# EAGLE board main (EAGLE 9.4.2), part 1 of 5
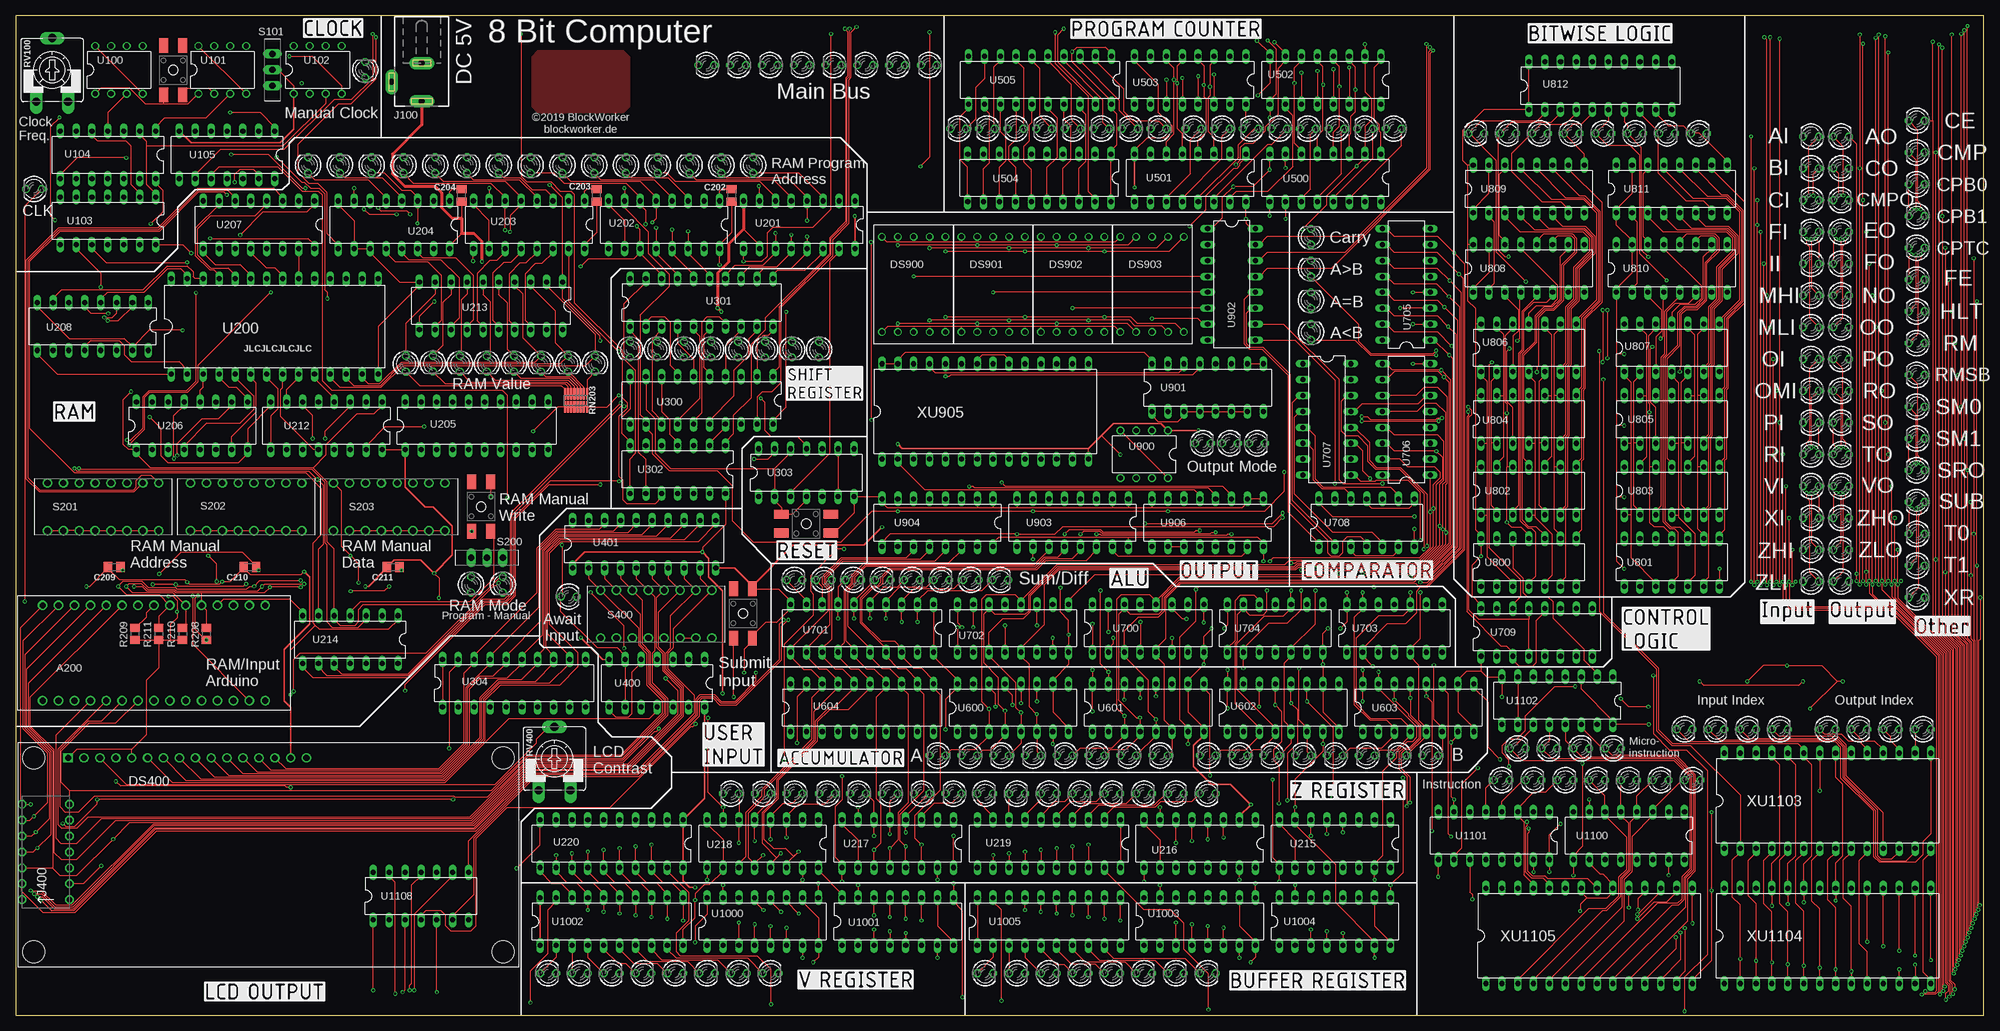
[diagram p13: board, top side]
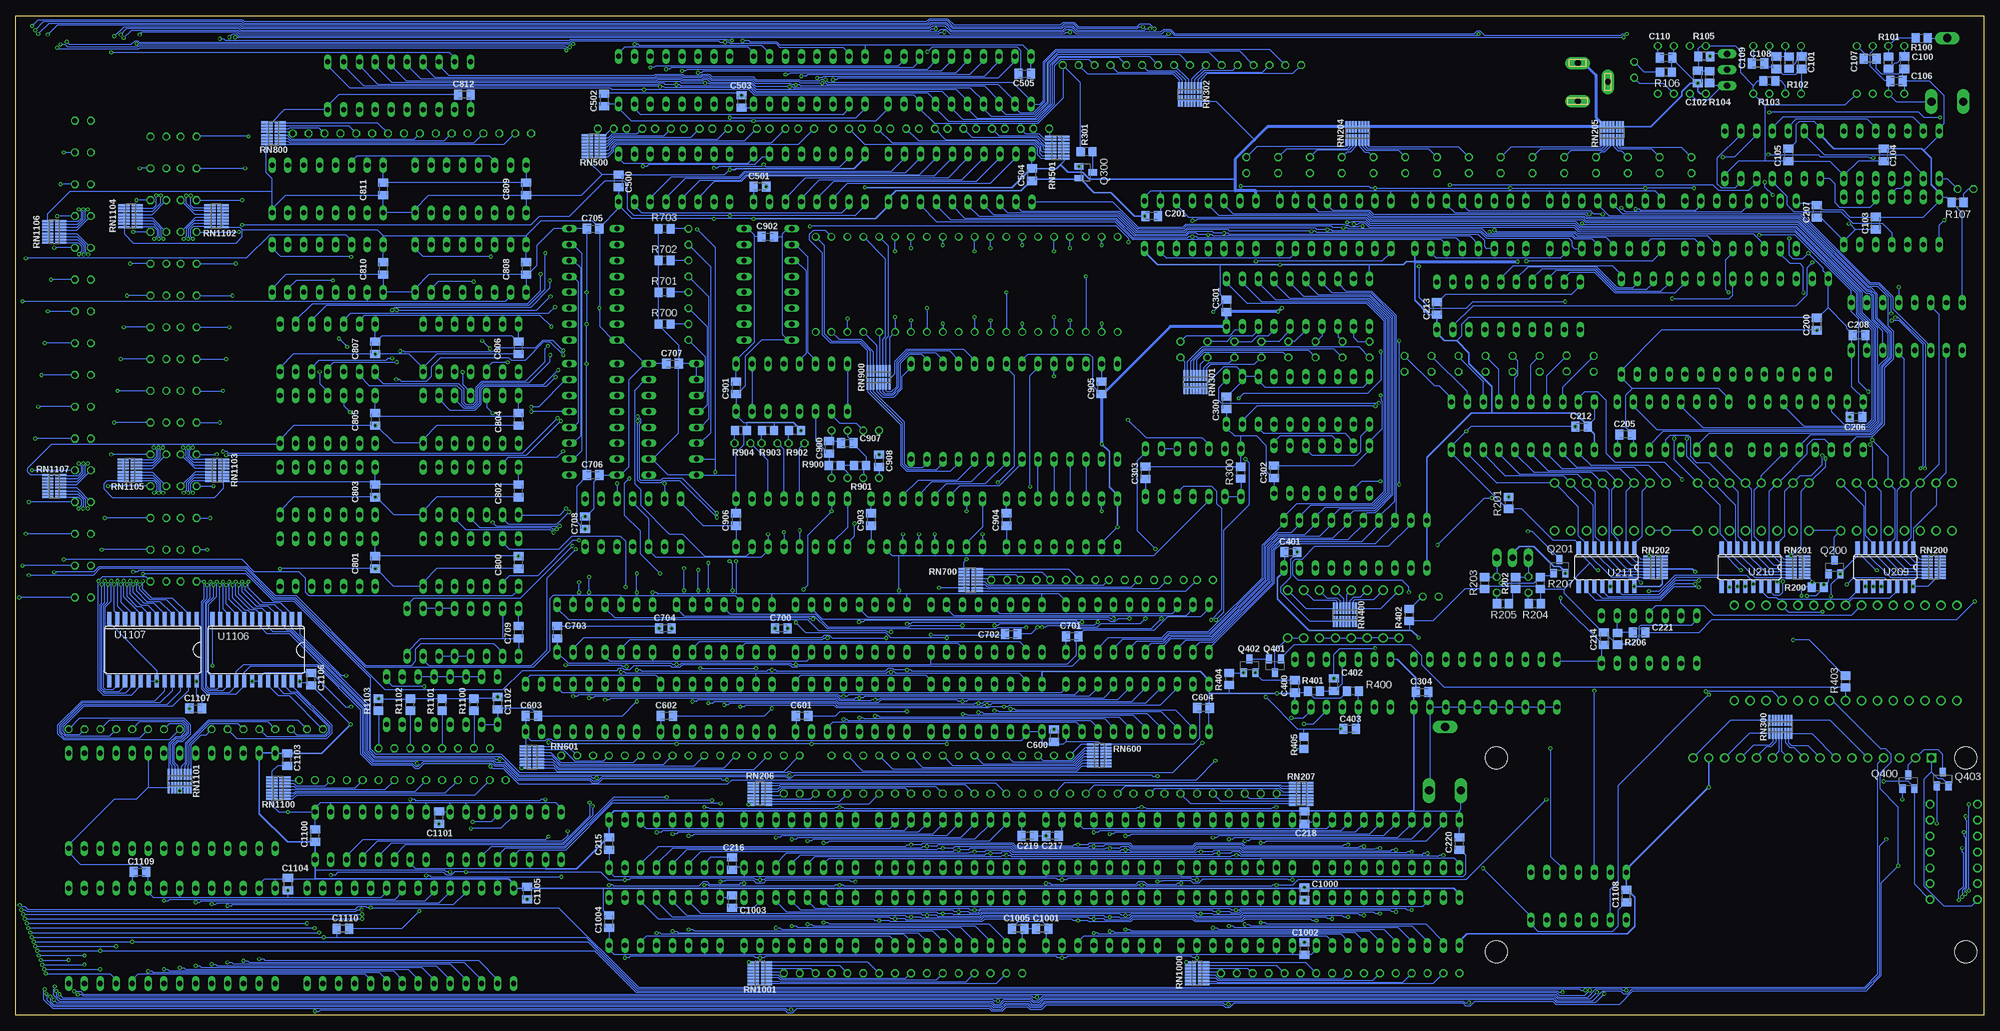
[diagram p14: board, bottom side, seen from below]

Size 314.53 x 159.79 mm. Coordinates in mm from the lower left corner, seen from the top.
Outline: 0,0 314.53,0 314.53,159.79 0,159.79 0,0
Copper layers (1*16): Top 0.035mm / dielectric 1.5mm / Bottom 0.035mm
Design rules "jlcpcb-2l": minimum track width 5mil, minimum drill 0.3mm, track to track 5mil, track to pad 5mil, pad to pad 5mil, via to via 5mil, smd to smd 0mil, copper to edge 0.25mm, drill to drill 6mil, minimum pad ring 6mil, minimum via ring 6mil, stop-mask expansion 4mil, vias tented up to drill 0.3mm, thermal gap 10mil

## Footprints (pad centres in the part's own frame; a part is rotated, then mirrored left to right if it is on the bottom)
ARDUINO_NANO_V3 = drill 1: 1 -17.78,-7.62; 2 -15.24,-7.62; 3 -12.7,-7.62; 4 -10.16,-7.62; 5 -7.62,-7.62; 6 -5.08,-7.62; 7 -2.54,-7.62; 8 0,-7.62; 9 2.54,-7.62; 10 5.08,-7.62; 11 7.62,-7.62; 12 10.16,-7.62; 13 12.7,-7.62; 14 15.24,-7.62; 15 17.78,-7.62; 16 17.78,7.62; 17 15.24,7.62; 18 12.7,7.62; 19 10.16,7.62; 20 7.62,7.62; 21 5.08,7.62; 22 2.54,7.62; 23 0,7.62; 24 -2.54,7.62; 25 -5.08,7.62; 26 -7.62,7.62; 27 -10.16,7.62; 28 -12.7,7.62; 29 -15.24,7.62; 30 -17.78,7.62
C0805K = smd 1.3 x 1.6: 1 -1,0; 2 1,0
HD44780_LCD = drill 1 square: 1 -32,15.5 | drill 1: 2 -29.46,15.5; 3 -26.92,15.5; 4 -24.38,15.5; 5 -21.84,15.5; 6 -19.3,15.5; 7 -16.76,15.5; 8 -14.22,15.5; 9 -11.68,15.5; 10 -9.14,15.5; 11 -6.6,15.5; 12 -4.06,15.5; 13 -1.52,15.5; 14 1.02,15.5; 15 3.56,15.5; 16 6.1,15.5 | hole 3.5: -37.5,15.5; 37.5,15.5; 37.5,-15.5; -37.5,-15.5
LED_7SEG = drill 0.8: 1 -5.08,-7.62; 2 -2.54,-7.62; 3 0,-7.62; 4 2.54,-7.62; 5 5.08,-7.62; 6 5.08,7.62; 7 2.54,7.62; 8 0,7.62; 9 -2.54,7.62; 10 -5.08,7.62
DCJ0202 = drill 1 pad 2 long: 1 0,3.1; 2 4.8,0; 3 0,-3
90152-14 = drill 0.9 octagon: 1 -3.81,-8.89; 2 3.81,-8.89; 3 -3.81,-6.35; 4 3.81,-6.35; 5 -3.81,-3.81; 6 3.81,-3.81; 7 -3.81,-1.27; 8 3.81,-1.27; 9 -3.81,1.27; 10 3.81,1.27; 11 -3.81,3.81; 12 3.81,3.81; 13 -3.81,6.35; 14 3.81,6.35
LED3MM = drill 0.813 octagon: A -1.27,0; K 1.27,0
SOT23 = smd 1 x 1.4: 1 -0.95,-1.1; 2 0.95,-1.1; 3 0,1.1
R0805 = smd 1.3 x 1.5: 1 -0.95,0; 2 0.95,0
CAY16102J8LF = smd 0.325 x 1.8: 1 -1.75,-1.05; 2 -1.25,-1.05; 3 -0.75,-1.05; 4 -0.25,-1.05; 5 0.25,-1.05; 6 0.75,-1.05; 7 1.25,-1.05; 8 1.75,-1.05; 9 -1.75,1.05; 10 -1.25,1.05; 11 -0.75,1.05; 12 -0.25,1.05; 13 0.25,1.05; 14 0.75,1.05; 15 1.25,1.05; 16 1.75,1.05
CA9V = drill 1.321 long: A -2.54,-5.08; E 2.54,-5.08; S 0,5.08
TL3305_MICROSWITCH = smd 2.3 x 1.4: 1 -1.7,0.75; 2 6.2,0.75; 3 -1.7,3.75; 4 6.2,3.75
ESP10 = drill 1 long: 1 0,2.54; 2 0,-2.54; C 0,0
DIPSW-08 = drill 1: A1 -8.89,-3.81; A2 -6.35,-3.81; A3 -3.81,-3.81; A4 -1.27,-3.81; A5 1.27,-3.81; A6 3.81,-3.81; A7 6.35,-3.81; A8 8.89,-3.81; B1 -8.89,3.81; B2 -6.35,3.81; B3 -3.81,3.81; B4 -1.27,3.81; B5 1.27,3.81; B6 3.81,3.81; B7 6.35,3.81; B8 8.89,3.81
DIL08 = drill 0.813 pad 1.27: 1 -3.81,-3.81; 2 -1.27,-3.81; 3 1.27,-3.81; 4 3.81,-3.81; 5 3.81,3.81; 6 1.27,3.81; 7 -1.27,3.81; 8 -3.81,3.81
DIL14 = drill 0.813 long: 1 -7.62,-3.81; 2 -5.08,-3.81; 3 -2.54,-3.81; 4 0,-3.81; 5 2.54,-3.81; 6 5.08,-3.81; 7 7.62,-3.81; 8 7.62,3.81; 9 5.08,3.81; 10 2.54,3.81; 11 0,3.81; 12 -2.54,3.81; 13 -5.08,3.81; 14 -7.62,3.81
DIL28-6 = drill 0.813 long: 1 -16.51,-7.62; 2 -13.97,-7.62; 3 -11.43,-7.62; 4 -8.89,-7.62; 5 -6.35,-7.62; 6 -3.81,-7.62; 7 -1.27,-7.62; 8 1.27,-7.62; 9 3.81,-7.62; 10 6.35,-7.62; 11 8.89,-7.62; 12 11.43,-7.62; 13 13.97,-7.62; 14 16.51,-7.62; 15 16.51,7.62; 16 13.97,7.62; 17 11.43,7.62; 18 8.89,7.62; 19 6.35,7.62; 20 3.81,7.62; 21 1.27,7.62; 22 -1.27,7.62; 23 -3.81,7.62; 24 -6.35,7.62; 25 -8.89,7.62; 26 -11.43,7.62; 27 -13.97,7.62; 28 -16.51,7.62
DIL16 = drill 0.813 long: 1 -8.89,-3.81; 2 -6.35,-3.81; 3 -3.81,-3.81; 4 -1.27,-3.81; 5 1.27,-3.81; 6 3.81,-3.81; 7 6.35,-3.81; 8 8.89,-3.81; 9 8.89,3.81; 10 6.35,3.81; 11 3.81,3.81; 12 1.27,3.81; 13 -1.27,3.81; 14 -3.81,3.81; 15 -6.35,3.81; 16 -8.89,3.81
SO16 = smd 0.66 x 2.032: 1 -4.445,-3.073; 2 -3.175,-3.073; 3 -1.905,-3.073; 4 -0.635,-3.073; 5 0.635,-3.073; 6 1.905,-3.073; 7 3.175,-3.073; 8 4.445,-3.073; 9 4.445,3.073; 10 3.175,3.073; 11 1.905,3.073; 12 0.635,3.073; 13 -0.635,3.073; 14 -1.905,3.073; 15 -3.175,3.073; 16 -4.445,3.073
DIL20 = drill 0.813 long: 1 -11.43,-3.81; 2 -8.89,-3.81; 3 -6.35,-3.81; 4 -3.81,-3.81; 5 -1.27,-3.81; 6 1.27,-3.81; 7 3.81,-3.81; 8 6.35,-3.81; 9 8.89,-3.81; 10 11.43,-3.81; 11 11.43,3.81; 12 8.89,3.81; 13 6.35,3.81; 14 3.81,3.81; 15 1.27,3.81; 16 -1.27,3.81; 17 -3.81,3.81; 18 -6.35,3.81; 19 -8.89,3.81; 20 -11.43,3.81
SO24W = smd 0.66 x 2.032: 1 -6.985,-5.029; 2 -5.715,-5.029; 3 -4.445,-5.029; 4 -3.175,-5.029; 5 -1.905,-5.029; 6 -0.635,-5.029; 7 0.635,-5.029; 8 1.905,-5.029; 9 3.175,-5.029; 10 4.445,-5.029; 11 5.715,-5.029; 12 6.985,-5.029; 13 6.985,5.029; 14 5.715,5.029; 15 4.445,5.029; 16 3.175,5.029; 17 1.905,5.029; 18 0.635,5.029; 19 -0.635,5.029; 20 -1.905,5.029; 21 -3.175,5.029; 22 -4.445,5.029; 23 -5.715,5.029; 24 -6.985,5.029
DIL28 = drill 0.813 long: 1 -16.51,-7.62; 2 -13.97,-7.62; 3 -11.43,-7.62; 4 -8.89,-7.62; 5 -6.35,-7.62; 6 -3.81,-7.62; 7 -1.27,-7.62; 8 1.27,-7.62; 9 3.81,-7.62; 10 6.35,-7.62; 11 8.89,-7.62; 12 11.43,-7.62; 13 13.97,-7.62; 14 16.51,-7.62; 15 16.51,7.62; 16 13.97,7.62; 17 11.43,7.62; 18 8.89,7.62; 19 6.35,7.62; 20 3.81,7.62; 21 1.27,7.62; 22 -1.27,7.62; 23 -3.81,7.62; 24 -6.35,7.62; 25 -8.89,7.62; 26 -11.43,7.62; 27 -13.97,7.62; 28 -16.51,7.62

## Placement (x,y rotation side)
A200  ARDUINO_NANO_V3  [ARDUINO_NANO_V3]  22.1,57.91 0 top
C100  0.1µF  [C0805K]  12.7,152.27 270 bottom
C101  0.1µF  [C0805K]  29.08,152.27 270 bottom
C102  0.1µF  [C0805K]  45.72,149.99 270 bottom
C103  0.1µF  [C0805K]  17.27,126.62 90 bottom
C104  0.1µF  [C0805K]  16,137.54 90 bottom
C105  0.1µF  [C0805K]  31.24,137.54 90 bottom
C106  0.68µF  [C0805K]  13.97,149.35 0 bottom
C107  10nF  [C0805K]  18.16,152.91 0 bottom
C108  1µF  [C0805K]  33.15,152.27 90 bottom
C109  10nF  [C0805K]  36.07,152.15 0 bottom
C110  10nF  [C0805K]  50.8,153.03 0 bottom
C200  0.1µF  [C0805K]  26.67,110.49 270 bottom
C201  0.1µF  [C0805K]  132.97,127.76 0 bottom
C202  0.1µF  [C0805K]  114.43,131.06 90 top
C203  0.1µF  [C0805K]  92.84,131.06 90 top
C204  0.1µF  [C0805K]  71.25,131.06 90 top
C205  0.1µF  [C0805K]  57.28,92.84 0 bottom
C206  0.1µF  [C0805K]  20.45,95.63 180 bottom
C207  0.1µF  [C0805K]  26.67,128.52 90 bottom
C208  0.1µF  [C0805K]  19.94,108.71 0 bottom
C209  0.1µF  [C0805K]  15.75,71.63 0 top
C210  0.1µF  [C0805K]  37.47,71.63 0 top
C211  0.1µF  [C0805K]  60.33,71.63 0 top
C212  0.1µF  [C0805K]  64.26,94.11 180 bottom
C213  0.1µF  [C0805K]  87.38,113.03 90 bottom
C214  0.1µF  [C0805K]  60.71,60.2 90 bottom
C215  0.1µF  [C0805K]  219.71,27.43 90 bottom
C216  0.1µF  [C0805K]  200.03,24.26 90 bottom
C217  0.1µF  [C0805K]  148.84,28.7 0 bottom
C218  0.1µF  [C0805K]  108.58,31.62 90 bottom
C219  0.1µF  [C0805K]  152.78,28.7 180 bottom
C220  0.1µF  [C0805K]  83.82,27.43 90 bottom
C221  10nF  [C0805K]  55.12,61.21 180 bottom
C300  0.1µF  [C0805K]  121.03,97.92 90 bottom
C301  0.1µF  [C0805K]  121.03,113.41 270 bottom
C302  0.1µF  [C0805K]  113.41,86.87 90 bottom
C303  0.1µF  [C0805K]  133.99,86.74 270 bottom
C304  0.1µF  [C0805K]  89.79,51.69 180 bottom
C400  0.1µF  [C0805K]  110.11,52.58 90 bottom
C401  0.1µF  [C0805K]  110.74,74.04 180 bottom
C402  10nF  [C0805K]  103.89,52.83 270 bottom
C403  10nF  [C0805K]  101.35,45.82 0 bottom
C500  0.1µF  [C0805K]  218.19,133.35 90 bottom
C501  0.1µF  [C0805K]  195.58,132.46 0 bottom
C502  0.1µF  [C0805K]  220.47,146.3 90 bottom
C503  0.1µF  [C0805K]  198.5,146.05 90 bottom
C504  0.1µF  [C0805K]  152.15,134.37 90 bottom
C505  0.1µF  [C0805K]  153.29,150.5 0 bottom
C600  0.1µF  [C0805K]  148.59,44.7 270 bottom
C601  0.1µF  [C0805K]  188.85,47.88 180 bottom
C602  0.1µF  [C0805K]  210.44,47.88 180 bottom
C603  0.1µF  [C0805K]  232.03,47.88 180 bottom
C604  0.1µF  [C0805K]  124.71,49.15 180 bottom
C700  0.1µF  [C0805K]  192.15,61.85 0 bottom
C701  0.1µF  [C0805K]  145.67,60.58 0 bottom
C702  0.1µF  [C0805K]  155.45,60.96 180 bottom
C703  0.1µF  [C0805K]  227.97,61.21 270 bottom
C704  0.1µF  [C0805K]  210.69,61.85 0 bottom
C705  0.1µF  [C0805K]  222.25,125.73 180 bottom
C706  0.1µF  [C0805K]  222.25,86.36 180 bottom
C707  0.1µF  [C0805K]  209.55,104.14 0 bottom
C708  0.1µF  [C0805K]  223.52,78.74 270 bottom
C709  0.1µF  [C0805K]  234.19,61.21 270 bottom
C800  0.1µF  [C0805K]  234.19,72.39 270 bottom
C801  0.1µF  [C0805K]  257.05,72.39 270 bottom
C802  0.1µF  [C0805K]  234.19,83.82 270 bottom
C803  0.1µF  [C0805K]  257.05,83.82 270 bottom
C804  0.1µF  [C0805K]  234.19,95.25 270 bottom
C805  0.1µF  [C0805K]  257.05,95.25 270 bottom
C806  0.1µF  [C0805K]  234.19,106.68 270 bottom
C807  0.1µF  [C0805K]  257.05,106.68 270 bottom
C808  0.1µF  [C0805K]  232.92,119.38 270 bottom
C809  0.1µF  [C0805K]  232.92,132.08 270 bottom
C810  0.1µF  [C0805K]  255.78,119.38 270 bottom
C811  0.1µF  [C0805K]  255.78,132.08 270 bottom
C812  0.1µF  [C0805K]  242.82,147.19 180 bottom
C900  0.1µF  [C0805K]  184.53,90.81 90 bottom
C901  0.1µF  [C0805K]  199.39,100.33 270 bottom
C902  0.1µF  [C0805K]  194.31,124.46 0 bottom
C903  0.1µF  [C0805K]  177.8,79.25 90 bottom
C904  0.1µF  [C0805K]  156.21,79.25 90 bottom
C905  0.1µF  [C0805K]  140.97,100.33 270 bottom
C906  0.1µF  [C0805K]  199.39,79.25 90 bottom
C907  10nF  [C0805K]  181.61,91.44 180 bottom
C908  10nF  [C0805K]  176.53,88.65 90 bottom
C1000  0.1µF  [C0805K]  108.58,19.43 270 bottom
C1001  0.1µF  [C0805K]  150.5,13.84 0 bottom
C1002  0.1µF  [C0805K]  108.58,10.67 270 bottom
C1003  0.1µF  [C0805K]  200.03,18.16 270 bottom
C1004  0.1µF  [C0805K]  219.71,14.99 270 bottom
C1005  0.1µF  [C0805K]  154.31,13.84 180 bottom
C1100  0.1µF  [C0805K]  266.7,28.7 90 bottom
C1101  0.1µF  [C0805K]  246.89,31.62 90 bottom
C1102  0.1µF  [C0805K]  237.49,49.91 90 bottom
C1103  0.1µF  [C0805K]  271.14,40.89 270 bottom
C1104  0.1µF  [C0805K]  271.02,20.95 270 bottom
C1105  0.1µF  [C0805K]  232.79,19.56 270 bottom
C1106  0.1µF  [C0805K]  267.33,53.72 90 bottom
C1107  0.1µF  [C0805K]  285.75,49.02 180 bottom
C1108  0.1µF  [C0805K]  57.15,19.05 270 bottom
C1109  0.1µF  [C0805K]  294.64,22.91 0 bottom
C1110  0.1µF  [C0805K]  262.25,13.84 0 bottom
DS400  HD44780_LCD  [HD44780_LCD]  40.39,25.65 0 top
DS900  LED_7SEG_CC  [LED_7SEG]  143.51,116.84 0 top
DS901  LED_7SEG_CC  [LED_7SEG]  156.21,116.84 0 top
DS902  LED_7SEG_CC  [LED_7SEG]  168.91,116.84 0 top
DS903  LED_7SEG_CC  [LED_7SEG]  181.61,116.84 0 top
J100  DCJ0202  [DCJ0202]  64.9,149.22 180 top
J400  90152-14  [90152-14]  4.8,27.38 0 top
LED100  yellow  [LED3MM]  55.88,151.13 90 top
LED101  blue  [LED3MM]  2.92,132.08 180 top
LED200  green  [LED3MM]  72.77,68.83 270 top
LED201  red  [LED3MM]  77.85,68.83 270 top
LED202  red  [LED3MM]  92.58,104.14 270 top
LED203  red  [LED3MM]  88.27,104.14 270 top
LED204  red  [LED3MM]  83.95,104.14 270 top
LED205  red  [LED3MM]  79.63,104.14 270 top
LED206  red  [LED3MM]  75.31,104.14 270 top
LED207  red  [LED3MM]  70.99,104.14 270 top
LED208  red  [LED3MM]  66.67,104.19 270 top
LED209  red  [LED3MM]  62.36,104.14 270 top
LED210  yellow  [LED3MM]  117.86,135.89 90 top
LED211  yellow  [LED3MM]  112.78,135.89 90 top
LED212  yellow  [LED3MM]  107.7,135.89 90 top
LED213  yellow  [LED3MM]  102.62,135.89 90 top
LED214  yellow  [LED3MM]  97.54,135.89 90 top
LED215  yellow  [LED3MM]  92.46,135.89 90 top
LED216  yellow  [LED3MM]  87.38,135.89 90 top
LED217  yellow  [LED3MM]  82.3,135.89 90 top
LED218  yellow  [LED3MM]  77.22,135.89 90 top
LED219  yellow  [LED3MM]  72.14,135.89 90 top
LED220  yellow  [LED3MM]  67.06,135.89 90 top
LED221  yellow  [LED3MM]  61.98,135.89 90 top
LED222  yellow  [LED3MM]  56.9,135.89 90 top
LED223  yellow  [LED3MM]  51.82,135.89 90 top
LED224  yellow  [LED3MM]  46.74,135.89 90 top
LED225  red  [LED3MM]  190.5,35.43 0 top
LED226  red  [LED3MM]  185.42,35.43 0 top
LED227  red  [LED3MM]  180.34,35.43 0 top
LED228  red  [LED3MM]  175.26,35.43 0 top
LED229  red  [LED3MM]  170.18,35.43 0 top
LED230  red  [LED3MM]  165.1,35.43 0 top
LED231  red  [LED3MM]  160.02,35.43 0 top
LED232  red  [LED3MM]  154.94,35.43 0 top
LED233  red  [LED3MM]  149.86,35.43 180 top
LED234  red  [LED3MM]  144.78,35.43 180 top
LED235  red  [LED3MM]  139.7,35.43 180 top
LED236  red  [LED3MM]  134.62,35.43 180 top
LED237  red  [LED3MM]  129.67,35.43 180 top
LED238  red  [LED3MM]  124.46,35.43 180 top
LED239  red  [LED3MM]  119.38,35.43 180 top
LED240  red  [LED3MM]  114.3,35.43 180 top
LED300  red  [LED3MM]  98.17,106.43 270 top
LED301  red  [LED3MM]  102.49,106.43 270 top
LED302  red  [LED3MM]  106.81,106.43 270 top
LED303  red  [LED3MM]  111.12,106.43 270 top
LED304  red  [LED3MM]  115.44,106.43 270 top
LED305  red  [LED3MM]  119.76,106.43 270 top
LED306  red  [LED3MM]  124.08,106.43 270 top
LED307  red  [LED3MM]  128.4,106.43 270 top
LED308  blue  [LED3MM]  110.36,151.89 180 top
LED309  blue  [LED3MM]  115.44,151.89 180 top
LED310  blue  [LED3MM]  120.52,151.89 180 top
LED311  blue  [LED3MM]  125.6,151.89 180 top
LED312  blue  [LED3MM]  130.68,151.89 180 top
LED313  blue  [LED3MM]  135.76,151.89 180 top
LED314  blue  [LED3MM]  140.84,151.89 180 top
LED315  blue  [LED3MM]  145.92,151.89 180 top
LED400  pink  [LED3MM]  88.39,66.93 0 top
LED500  green  [LED3MM]  188.21,141.73 180 top
LED501  green  [LED3MM]  192.79,141.73 180 top
LED502  green  [LED3MM]  197.36,141.73 180 top
LED503  green  [LED3MM]  201.93,141.73 180 top
LED504  green  [LED3MM]  206.5,141.73 180 top
LED505  green  [LED3MM]  211.07,141.73 180 top
LED506  green  [LED3MM]  215.65,141.73 180 top
LED507  green  [LED3MM]  220.22,141.73 180 top
LED508  green  [LED3MM]  150.62,141.73 180 top
LED509  green  [LED3MM]  155.19,141.73 180 top
LED510  green  [LED3MM]  159.77,141.73 180 top
LED511  green  [LED3MM]  164.34,141.73 180 top
LED512  green  [LED3MM]  168.91,141.73 180 top
LED513  green  [LED3MM]  173.48,141.73 180 top
LED514  green  [LED3MM]  178.05,141.73 180 top
LED515  green  [LED3MM]  182.63,141.73 180 top
LED600  red  [LED3MM]  147.32,41.53 180 top
LED601  red  [LED3MM]  152.4,41.53 180 top
LED602  red  [LED3MM]  157.48,41.53 180 top
LED603  red  [LED3MM]  162.56,41.53 180 top
LED604  red  [LED3MM]  167.64,41.53 180 top
LED605  red  [LED3MM]  172.72,41.53 180 top
LED606  red  [LED3MM]  177.8,41.53 180 top
LED607  red  [LED3MM]  182.88,41.53 180 top
LED608  red  [LED3MM]  190.5,41.53 180 top
LED609  red  [LED3MM]  195.58,41.53 180 top
LED610  red  [LED3MM]  200.66,41.53 180 top
LED611  red  [LED3MM]  205.74,41.53 180 top
LED612  red  [LED3MM]  210.82,41.53 180 top
LED613  red  [LED3MM]  215.9,41.53 180 top
LED614  red  [LED3MM]  220.98,41.53 180 top
LED615  red  [LED3MM]  226.06,41.53 180 top
LED700  yellow  [LED3MM]  124.46,69.6 0 top
LED701  yellow  [LED3MM]  129.16,69.6 0 top
LED702  yellow  [LED3MM]  133.86,69.6 0 top
LED703  yellow  [LED3MM]  138.56,69.6 0 top
LED704  yellow  [LED3MM]  143.26,69.6 0 top
LED705  yellow  [LED3MM]  147.96,69.6 0 top
LED706  yellow  [LED3MM]  152.65,69.6 0 top
LED707  yellow  [LED3MM]  157.35,69.6 0 top
LED708  green  [LED3MM]  207.01,109.22 90 top
LED709  green  [LED3MM]  207.01,114.3 90 top
LED710  green  [LED3MM]  207.01,119.38 90 top
LED711  green  [LED3MM]  207.01,124.46 90 top
LED800  yellow  [LED3MM]  233.43,140.97 0 top
LED801  yellow  [LED3MM]  238.51,140.97 0 top
LED802  yellow  [LED3MM]  243.59,140.97 0 top
LED803  yellow  [LED3MM]  248.67,140.97 0 top
LED804  yellow  [LED3MM]  253.75,140.97 0 top
LED805  yellow  [LED3MM]  258.83,140.97 0 top
LED806  yellow  [LED3MM]  263.91,140.97 0 top
LED807  yellow  [LED3MM]  268.99,140.97 0 top
LED900  green  [LED3MM]  189.74,91.44 0 top
LED901  green  [LED3MM]  194.06,91.44 0 top
LED902  green  [LED3MM]  198.37,91.44 0 top
LED1000  red  [LED3MM]  85.09,6.73 0 top
LED1001  red  [LED3MM]  90.17,6.73 0 top
LED1002  red  [LED3MM]  95.25,6.73 0 top
LED1003  red  [LED3MM]  100.33,6.73 0 top
LED1004  red  [LED3MM]  105.41,6.73 0 top
LED1005  red  [LED3MM]  110.49,6.73 0 top
LED1006  red  [LED3MM]  115.57,6.73 0 top
LED1007  red  [LED3MM]  120.65,6.73 0 top
LED1008  red  [LED3MM]  154.94,6.73 0 top
LED1009  red  [LED3MM]  160.02,6.73 0 top
LED1010  red  [LED3MM]  165.1,6.73 0 top
LED1011  red  [LED3MM]  170.18,6.73 0 top
LED1012  red  [LED3MM]  175.26,6.73 0 top
LED1013  red  [LED3MM]  180.34,6.73 0 top
LED1014  red  [LED3MM]  185.42,6.73 0 top
LED1015  red  [LED3MM]  190.5,6.73 0 top
LED1100  green  [LED3MM]  237.49,37.59 0 top
LED1101  green  [LED3MM]  242.57,37.59 0 top
LED1102  green  [LED3MM]  247.65,37.59 0 top
LED1103  green  [LED3MM]  252.73,37.59 0 top
LED1104  green  [LED3MM]  257.81,37.59 0 top
LED1105  green  [LED3MM]  262.89,37.59 0 top
LED1106  green  [LED3MM]  267.97,37.59 0 top
LED1107  yellow  [LED3MM]  240.03,42.67 0 top
LED1108  yellow  [LED3MM]  245.11,42.67 0 top
LED1109  yellow  [LED3MM]  250.19,42.67 0 top
LED1110  yellow  [LED3MM]  255.27,42.67 0 top
LED1111  yellow  [LED3MM]  289.56,45.72 0 top
LED1112  yellow  [LED3MM]  294.64,45.72 0 top
LED1113  yellow  [LED3MM]  299.72,45.72 0 top
LED1114  yellow  [LED3MM]  304.8,45.72 0 top
LED1115  yellow  [LED3MM]  266.7,45.72 0 top
LED1116  yellow  [LED3MM]  271.78,45.72 0 top
LED1117  yellow  [LED3MM]  276.86,45.72 0 top
LED1118  yellow  [LED3MM]  281.94,45.72 0 top
LED1119  white  [LED3MM]  286.89,140.46 180 top
LED1120  white  [LED3MM]  286.89,135.38 180 top
LED1121  white  [LED3MM]  286.89,130.3 180 top
LED1122  white  [LED3MM]  286.89,125.22 180 top
LED1123  white  [LED3MM]  286.89,120.14 180 top
LED1124  white  [LED3MM]  286.89,115.06 180 top
LED1125  white  [LED3MM]  286.89,109.98 180 top
LED1126  white  [LED3MM]  286.89,104.9 180 top
LED1127  white  [LED3MM]  286.89,99.82 180 top
LED1128  white  [LED3MM]  286.89,94.74 180 top
LED1129  white  [LED3MM]  286.89,89.66 180 top
LED1130  white  [LED3MM]  286.89,84.58 180 top
LED1131  white  [LED3MM]  286.89,79.5 180 top
LED1132  white  [LED3MM]  286.89,74.42 180 top
LED1133  white  [LED3MM]  286.89,69.34 180 top
LED1134  white  [LED3MM]  291.72,140.46 0 top
LED1135  white  [LED3MM]  291.72,135.38 0 top
LED1136  white  [LED3MM]  291.72,130.3 0 top
LED1137  white  [LED3MM]  291.72,125.22 0 top
LED1138  white  [LED3MM]  291.72,120.14 0 top
LED1139  white  [LED3MM]  291.72,115.06 0 top
LED1140  white  [LED3MM]  291.72,109.98 0 top
LED1141  white  [LED3MM]  291.72,104.9 0 top
LED1142  white  [LED3MM]  291.72,99.82 0 top
LED1143  white  [LED3MM]  291.72,94.74 0 top
LED1144  white  [LED3MM]  291.72,89.66 0 top
LED1145  white  [LED3MM]  291.72,84.58 0 top
LED1146  white  [LED3MM]  291.72,79.5 0 top
LED1147  white  [LED3MM]  291.72,74.42 0 top
LED1148  white  [LED3MM]  291.72,69.34 0 top
LED1149  white  [LED3MM]  303.78,143 180 top
LED1150  white  [LED3MM]  303.78,137.92 180 top
LED1151  white  [LED3MM]  303.78,132.84 180 top
LED1152  white  [LED3MM]  303.78,127.76 180 top
LED1153  white  [LED3MM]  303.78,122.68 180 top
LED1154  white  [LED3MM]  303.78,117.6 180 top
LED1155  white  [LED3MM]  303.78,112.52 180 top
LED1156  white  [LED3MM]  303.78,107.44 180 top
LED1157  white  [LED3MM]  303.78,102.36 180 top
LED1158  white  [LED3MM]  303.78,97.28 180 top
LED1159  white  [LED3MM]  303.78,92.2 180 top
LED1160  white  [LED3MM]  303.78,87.12 180 top
LED1161  white  [LED3MM]  303.78,82.04 180 top
LED1162  white  [LED3MM]  303.78,76.96 180 top
LED1163  white  [LED3MM]  303.78,71.88 180 top
LED1164  white  [LED3MM]  303.78,66.8 180 top
Q200  NMOS  [SOT23]  23.88,71.63 0 bottom
Q201  PMOS  [SOT23]  67.82,71.75 0 bottom
Q300  PMOS  [SOT23]  143.51,134.75 270 bottom
Q400  PMOS  [SOT23]  12.06,37.34 0 bottom
Q401  NMOS  [SOT23]  113.28,55.88 180 bottom
Q402  NMOS  [SOT23]  117.35,55.88 0 bottom
Q403  NMOS  [SOT23]  6.58,37.77 0 bottom
R100  150Ω  [R0805]  9.91,156.21 0 bottom
R101  150Ω  [R0805]  15.24,152.27 90 bottom
R102  200kΩ  [R0805]  31.11,152.27 90 bottom
R103  1kΩ  [R0805]  34.29,149.35 180 bottom
R104  1kΩ  [R0805]  43.81,149.99 90 bottom
R105  1kΩ  [R0805]  44.7,153.29 180 bottom
R106  330Ω  [R0805]  50.8,150.75 180 bottom
R107  330Ω?  [R0805]  4.19,129.92 0 bottom
R200  10kΩ  [R0805]  26.54,68.45 180 bottom
R201  1kΩ  [R0805]  75.95,81.92 270 bottom
R202  1kΩ  [R0805]  74.8,69.09 90 bottom
R203  1kΩ  [R0805]  79.76,69.09 90 bottom
R204  330Ω  [R0805]  71.75,65.79 180 bottom
R205  330Ω  [R0805]  76.83,65.79 180 bottom
R206  1kΩ  [R0805]  58.55,60.2 270 bottom
R207  10kΩ  [R0805]  70.87,69.09 90 bottom
R208  10kΩ  [R0805]  30.48,60.96 270 top
R209  10kΩ  [R0805]  19.05,60.96 270 top
R210  10kΩ  [R0805]  26.67,60.96 270 top
R211  10kΩ  [R0805]  22.86,60.96 270 top
R300  1kΩ  [R0805]  118.75,86.74 90 bottom
R301  330Ω?  [R0805]  143.38,138.05 180 bottom
R400  1kΩ  [R0805]  100.84,51.82 180 bottom
R401  1kΩ  [R0805]  107.06,51.82 180 bottom
R402  330Ω?  [R0805]  91.82,64.01 90 bottom
R403  10kΩ  [R0805]  22.1,53.34 90 bottom
R404  10kΩ  [R0805]  120.6,53.77 270 bottom
R405  1kΩ  [R0805]  108.66,43.56 270 bottom
R700  330Ω?  [R0805]  210.82,110.49 180 bottom
R701  330Ω?  [R0805]  210.82,115.57 180 bottom
R702  330Ω?  [R0805]  210.82,120.65 180 bottom
R703  330Ω?  [R0805]  210.82,125.73 180 bottom
R900  1kΩ  [R0805]  183.64,87.88 0 bottom
R901  100kΩ  [R0805]  179.58,87.88 0 bottom
R902  330Ω?  [R0805]  189.99,93.47 180 bottom
R903  330Ω?  [R0805]  194.31,93.47 180 bottom
R904  330Ω?  [R0805]  198.63,93.47 180 bottom
R1100  330Ω?  [R0805]  241.3,49.66 90 bottom
R1101  330Ω?  [R0805]  246.38,49.66 90 bottom
R1102  330Ω?  [R0805]  251.46,49.66 90 bottom
R1103  330Ω?  [R0805]  256.54,49.66 90 bottom
RN200  8x1kΩ?  [CAY16102J8LF]  8,71.63 270 bottom
RN201  8x1kΩ?  [CAY16102J8LF]  29.72,71.63 270 bottom
RN202  8x1kΩ?  [CAY16102J8LF]  52.45,71.63 270 bottom
RN203  8x220Ω?  [CAY16102J8LF]  89.53,98.3 180 top
RN204  8x220Ω?  [CAY16102J8LF]  100.08,140.97 0 bottom
RN205  8x220Ω?  [CAY16102J8LF]  59.44,140.97 0 bottom
RN206  8x220Ω?  [CAY16102J8LF]  195.58,35.43 90 bottom
RN207  8x220Ω?  [CAY16102J8LF]  109.09,35.43 270 bottom
RN300  8x4.7kΩ  [CAY16102J8LF]  32.51,46.1 0 bottom
RN301  8x220Ω?  [CAY16102J8LF]  125.98,101.22 180 bottom
RN302  8x220Ω?  [CAY16102J8LF]  126.87,147.19 180 bottom
RN400  8x1kΩ?  [CAY16102J8LF]  102.11,64.01 180 bottom
RN500  8x220Ω?  [CAY16102J8LF]  222.12,138.94 90 bottom
RN501  8x220Ω?  [CAY16102J8LF]  148.08,138.68 270 bottom
RN600  8x220Ω?  [CAY16102J8LF]  141.35,41.53 270 bottom
RN601  8x220Ω?  [CAY16102J8LF]  232.03,41.27 90 bottom
RN700  8x220Ω?  [CAY16102J8LF]  161.93,69.6 90 bottom
RN800  8x220Ω?  [CAY16102J8LF]  273.3,140.97 90 bottom
RN900  8x220Ω?  [CAY16102J8LF]  176.66,101.98 0 bottom
RN1000  8x220Ω?  [CAY16102J8LF]  125.73,6.73 90 bottom
RN1001  8x220Ω?  [CAY16102J8LF]  195.58,6.73 90 bottom
RN1100  8x220Ω?  [CAY16102J8LF]  272.54,36.32 90 bottom
RN1101  8x220Ω?  [CAY16102J8LF]  288.29,37.47 180 bottom
RN1102  8x220Ω?  [CAY16102J8LF]  282.45,127.76 270 bottom
RN1103  8x220Ω?  [CAY16102J8LF]  282.32,87.12 270 bottom
RN1104  8x220Ω?  [CAY16102J8LF]  296.16,127.76 90 bottom
RN1105  8x220Ω?  [CAY16102J8LF]  296.29,87.12 90 bottom
RN1106  8x220Ω?  [CAY16102J8LF]  308.36,125.22 90 bottom
RN1107  8x220Ω?  [CAY16102J8LF]  308.36,84.58 90 bottom
RV100  1MΩ  [CA9V]  5.84,151.13 0 top
RV400  10kΩ  [CA9V]  86.11,41.02 0 top
S100  TL3305  [TL3305_MICROSWITCH]  27.43,148.84 90 top
S101  ESP10  [ESP10]  41.02,151.13 0 top
S200  ESP10  [ESP10]  75.31,73.15 90 top
S201  DS-08  [DIPSW-08]  13.97,81.28 180 top
S202  DS-08  [DIPSW-08]  36.83,81.28 180 top
S203  DS-08  [DIPSW-08]  59.69,81.28 180 top
S204  TL3305  [TL3305_MICROSWITCH]  72.14,83.57 270 top
S300  TL3305  [TL3305_MICROSWITCH]  124.08,76.33 0 top
S400  DS-08  [DIPSW-08]  102.36,64.14 180 top
S401  TL3305  [TL3305_MICROSWITCH]  118.49,61.98 90 top
U100  NE555N  [DIL08]  16.51,151.13 0 top
U101  NE555N  [DIL08]  33.02,151.13 0 top
U102  NE555N  [DIL08]  48.26,151.13 0 top
U103  74LS04N  [DIL14]  14.73,127 180 top
U104  74LS08N  [DIL14]  14.73,137.54 180 top
U105  74LS32N  [DIL14]  33.78,137.54 180 top
U200  HM62256  [DIL28-6]  41.4,110.11 0 top
U201  74LS173N  [DIL16]  125.22,126.36 180 top
U202  74LS173N  [DIL16]  103.63,126.36 180 top
U203  74LS173N  [DIL16]  82.04,126.36 180 top
U204  74LS173N  [DIL16]  60.45,126.36 180 top
U205  74LS157N  [DIL16]  49.66,94.23 180 top
U206  74LS157N  [DIL16]  28.19,94.23 0 top
U207  74LS157N  [DIL16]  38.86,126.36 180 top
U208  74LS157N  [DIL16]  12.32,110.11 180 top
U209  74HCT595D  [SO16]  15.75,71.63 180 bottom
U210  74HCT595D  [SO16]  37.47,71.63 180 bottom
U211  74HCT595D  [SO16]  60.33,71.63 180 bottom
U212  74LS245N  [DIL20]  73.66,94.23 0 top
U213  74LS245N  [DIL20]  75.95,113.41 180 top
U214  74LS00N  [DIL14]  53.47,60.07 180 top
U215  74LS173N  [DIL16]  210.82,27.43 180 top
U216  74LS173N  [DIL16]  189.23,27.43 180 top
U217  74LS173N  [DIL16]  140.97,27.43 180 top
U218  74LS173N  [DIL16]  119.38,27.43 180 top
U219  74LS245N  [DIL20]  165.1,27.43 180 top
U220  74LS245N  [DIL20]  95.25,27.43 180 top
U300  74LS299N  [DIL20]  109.6,98.3 180 top
U301  74LS245N  [DIL20]  109.6,113.92 0 top
U302  74LS08N  [DIL14]  105.79,87.25 180 top
U303  74LS00N  [DIL14]  126.36,86.74 0 top
U304  74LS245N  [DIL20]  79.63,53.09 0 top
U400  74LS00N  [DIL14]  102.49,53.09 180 top
U401  74LS245N  [DIL20]  100.46,75.31 0 top
U500  74LS161N  [DIL16]  209.3,133.86 180 top
U501  74LS161N  [DIL16]  187.71,133.86 180 top
U502  74LS161N  [DIL16]  209.3,149.48 180 top
U503  74LS161N  [DIL16]  187.71,149.48 180 top
U504  74LS245N  [DIL20]  163.58,133.86 180 top
U505  74LS245N  [DIL20]  163.7,149.48 180 top
U600  74LS173N  [DIL16]  159.38,49.15 0 top
U601  74LS173N  [DIL16]  180.97,49.15 0 top
U602  74LS173N  [DIL16]  202.56,49.15 0 top
U603  74LS173N  [DIL16]  224.16,49.15 0 top
U604  74LS245N  [DIL20]  135.25,49.15 0 top
U700  74LS283N  [DIL16]  180.97,61.85 0 top
U701  74LS283N  [DIL16]  159.38,61.85 0 top
U702  74LS245N  [DIL20]  135.25,61.85 180 top
U703  74LS86N  [DIL14]  220.34,61.85 0 top
U704  74LS86N  [DIL14]  201.29,61.85 0 top
U705  74LS85N  [DIL16]  222.25,116.84 90 top
U706  74LS85N  [DIL16]  222.25,95.25 90 top
U707  74LS173N  [DIL16]  209.55,95.25 270 top
U708  74LS125N  [DIL14]  215.9,78.74 0 top
U709  74LS153N  [DIL16]  243.08,61.21 0 top
U800  74LS04N  [DIL14]  241.81,72.39 0 top
U801  74LS04N  [DIL14]  264.67,72.39 0 top
U802  74LS08N  [DIL14]  241.81,83.82 0 top
U803  74LS08N  [DIL14]  264.67,83.82 0 top
U804  74LS32N  [DIL14]  241.81,95.25 0 top
U805  74LS32N  [DIL14]  264.67,95.25 0 top
U806  74LS86N  [DIL14]  241.81,106.68 0 top
U807  74LS86N  [DIL14]  264.67,106.68 0 top
U808  74LS153N  [DIL16]  241.81,119.38 0 top
U809  74LS153N  [DIL16]  241.81,132.08 0 top
U810  74LS153N  [DIL16]  264.67,119.38 0 top
U811  74LS153N  [DIL16]  264.67,132.08 0 top
U812  74LS245N  [DIL20]  253.24,148.59 0 top
U900  NE555N  [DIL08]  180.34,89.66 180 top
U901  74LS161N  [DIL16]  190.5,100.33 0 top
U902  74LS139N  [DIL16]  194.31,116.84 270 top
U903  74LS173N  [DIL16]  168.91,78.74 180 top
U904  74LS173N  [DIL16]  147.32,78.74 180 top
U906  74LS173N  [DIL16]  190.5,78.74 180 top
U1000  74LS173N  [DIL16]  119.38,14.99 0 top
U1001  74LS173N  [DIL16]  140.97,14.99 0 top
U1002  74LS245N  [DIL20]  95.25,14.99 0 top
U1003  74LS173N  [DIL16]  189.23,14.99 0 top
U1004  74LS173N  [DIL16]  210.82,14.99 0 top
U1005  74LS245N  [DIL20]  165.1,14.99 0 top
U1100  74LS173N  [DIL16]  257.81,28.7 180 top
U1101  74LS173N  [DIL16]  236.22,28.7 180 top
U1102  74LS161N  [DIL16]  246.38,50.29 180 top
U1106  74HCT154DW  [SO24W]  276.1,58.42 180 bottom
U1107  74HCT154DW  [SO24W]  292.61,58.42 180 bottom
U1108  74LS04N  [DIL14]  64.77,19.05 0 top
XU905  AT28C64B  [DIL28]  154.94,96.52 0 top
XU1103  AT28C64B  [DIL28]  289.56,34.29 0 top
XU1104  AT28C64B  [DIL28]  289.56,12.7 0 top
XU1105  AT28C64B  [DIL28]  251.46,12.7 0 top

## Tracks (layer width: path | path; a pad name or v marks a point on that pad's centre or on a via)
!AI  (via drill 0.3 pad 0.55)
  Top 0.152: v277.33,69.3 v277.33,140.49 | v190.88,38.38 190.88,51.34 189.87,52.35 U601.9
  Bottom 0.152: U601.9 189.87,53.57 189.03,54.41 169.11,54.41 168.28,53.57 U600.9 | v277.33,69.3 277.33,68.29 274.95,65.91 272.16,65.91 270.38,64.14 U1106.2 270.38,61.82 258.06,49.51 258.06,42.44 257.05,41.43 237.01,41.43 234.04,38.46 190.96,38.46 v190.88,38.38 | v277.33,140.49 285.6,140.49 LED1119.K
!AO  (via drill 0.3, 0.3 pad 0.55)
  Top 0.152: v294.2,69.4 v294.2,70.59 294.2,139.25 LED1134.K | U604.19 126.36,52.38 124.89,50.9 v124.89,43.54
  Bottom 0.152: U1107.2 286.89,64.14 289.41,66.65 292.68,66.65 294.2,68.17 v294.2,69.4 | v124.89,43.54 129.69,38.73 190.52,38.73 190.67,38.88 191.09,38.88 191.24,38.73 233.92,38.73 236.89,41.71 256.93,41.71 257.79,42.56 257.79,53.95 270.03,66.19 273.3,66.19 277.7,70.59 v294.2,70.59
!BI  (via drill 0.3 pad 0.55)
  Top 0.152: v277.84,68.77 v277.84,135.38 | v237.21,40.92 235.23,42.9 235.23,50.16 233.04,52.35 U603.9
  Bottom 0.152: U602.9 211.46,53.59 212.27,54.41 232.21,54.41 233.04,53.57 U603.9 | v277.84,68.77 277.84,67.99 275.49,65.63 273.15,65.63 271.65,64.14 U1106.3 271.65,62.08 271.2,61.62 270.57,61.62 258.34,49.39 258.34,42.33 257.16,41.15 238.1,41.15 237.87,40.92 v237.21,40.92 | LED1120.K v277.84,135.38
!CI  (via drill 0.3, 0.3 pad 0.55)
  Top 0.152: v200.41,127.81 U500.9 | v278.35,69.3 v278.35,126.34 v278.35,130.3
  Bottom 0.152: U501.9 178.82,129.41 180.41,127.81 v200.41,127.81 215.72,127.81 216.74,128.83 216.74,132.82 217.27,133.35 220.42,133.35 226.11,127.66 230.91,127.66 232.23,126.34 v278.35,126.34 | U1106.4 272.92,64.14 274.14,65.35 276,65.35 278.35,67.7 v278.35,69.3 | LED1121.K v278.35,130.3
!CLK
  Top 0.152: U800.12 239.27,71.5 240.84,69.93 240.84,67.59 241.48,66.95 244.81,66.95 245.62,66.14 245.62,63.55 250.62,58.55 250.62,56.79 252.73,54.69 U1102.2
!CLK_ENABLE
  Bottom 0.152: U103.3 17.27,130.1 18.26,129.11 22.99,129.11 23.82,129.95 23.82,132.97 24.59,133.73 U105.8
!CLK_SWITCH
  Top 0.152: U103.2 19.81,131.42 18.49,132.74 18.49,138.94 17.7,139.72 13.11,139.72 12.19,140.64 U104.5
!CMP  (via drill 0.3)
  Top 0.152: v224.51,75.95 224.51,83.55 222.57,85.49 217.37,85.49 217.2,85.32 215.01,85.32 213.97,86.36 U707.9
  Bottom 0.152: U800.2 236.73,69.19 235.59,70.33 231.04,70.33 225.43,75.95 v224.51,75.95
!CMP_CA_OUT  (via drill 0.3)
  Top 0.152: U902.9 204.42,107.95 210.82,101.55 v210.82,84.99
  Bottom 0.152: v210.82,84.99 U708.13
!CMP_EQ_OUT
  Top 0.152: U902.11 197.49,113.03 196.6,112.14 196.6,107.47 197.26,106.81 199.31,106.81 203.63,102.49 203.63,81.97 209.6,76 209.6,74.02 210.21,73.41 211.51,73.41 212.06,73.97 212.06,75.82 212.8,76.56 214.91,76.56 215.9,75.56 U708.4
!CMP_GT_OUT  (via drill 0.3)
  Top 0.152: U902.10 202.62,110.49 211.43,101.68 211.43,85.65 212.09,84.99 v218.41,84.99
  Bottom 0.152: v218.41,84.99 218.41,82.58 U708.10
!CMP_LT_OUT
  Top 0.152: U902.12 197.51,115.57 196.32,114.38 196.32,107.35 197.14,106.53 199.17,106.53 203.35,102.35 203.35,80.44 208.28,75.51 U708.1
!CMPO  (via drill 0.3, 0.3 pad 0.55)
  Top 0.152: v295.21,69.4 v295.21,130.3 v295.21,155.3 | v225.45,155.26 225.45,135.38 214.5,124.44 199.97,124.44 198.73,123.19 U902.15
  Bottom 0.152: U1107.4 289.43,64.14 291.39,66.09 293.47,66.09 295.21,67.83 v295.21,69.4 | LED1136.K v295.21,130.3 | v295.21,155.3 295.18,155.26 v225.45,155.26
!CO  (via drill 0.3, 0.3 pad 0.55)
  Top 0.152: v294.71,68.87 v294.71,135.38 v294.71,156.77 | v166.12,157.14 166.12,152.22 171.35,146.99 171.35,131.78 172.47,130.66 U504.19
  Bottom 0.152: U1107.3 288.16,64.14 290.4,66.37 293.04,66.37 294.71,68.04 v294.71,68.87 | LED1135.K v294.71,135.38 | v294.71,156.77 294.28,157.2 279.09,157.2 278.81,156.92 167,156.92 166.78,157.14 v166.12,157.14
!EO  (via drill 0.3, 0.3 pad 0.55)
  Top 0.152: v295.72,68.88 v295.72,70.89 v295.72,125.22
  Bottom 0.152: U1107.5 290.7,64.14 292.38,65.81 293.95,65.81 295.72,67.58 v295.72,68.88 | LED1137.K v295.72,125.22 | U702.19 144.15,57.4 145.75,55.8 189.44,55.8 189.66,55.58 190.41,55.58 190.83,56.01 207.99,56.01 208.42,55.58 209.63,55.58 209.87,55.82 215.8,55.82 216.4,55.22 217.2,55.22 217.42,55.44 218.14,55.44 218.52,55.07 233.63,55.07 236.68,52.02 255.46,52.02 269.91,66.47 273.19,66.47 277.83,71.12 294.86,71.12 295.09,70.89 v295.72,70.89
!FE  (via drill 0.3)
  Top 0.152: U304.19 70.74,56.29 69.26,54.81 v69.26,42.67
  Bottom 0.152: v69.26,42.67 69.26,25.42 67.31,23.47 U1108.10
!FI  (via drill 0.3, 0.3 pad 0.55)
  Top 0.152: U1003.9 v198.12,21.11 | U1004.9 v219.71,20.83 221.69,22.81 v221.69,37.95 | v278.86,68.78 v278.86,125.22
  Bottom 0.152: v198.12,21.11 198.73,21.11 198.96,20.88 203.52,20.88 203.97,21.33 204.68,21.33 205.41,20.6 218.87,20.6 219.1,20.83 v219.71,20.83 | v278.86,68.78 278.86,67.38 276.56,65.08 275.13,65.08 274.19,64.14 U1106.5 274.19,62.1 273.43,61.34 270.69,61.34 258.62,49.27 258.62,42.21 257.28,40.87 238.22,40.87 237.76,40.41 237.21,40.41 236.39,40.41 234.15,38.18 222.6,38.18 222.38,37.95 v221.69,37.95 | LED1122.K v278.86,125.22
!FO  (via drill 0.3, 0.3 pad 0.55)
  Top 0.152: v296.23,120.14 v296.23,69.41 296.23,67.48 298.04,65.66 299.86,65.66 307.8,57.73 307.8,4.24 308.02,4.01 v308.02,3.88 | v157.53,2.31 157.53,16.84 156.21,18.16 U1005.19
  Bottom 0.152: U1107.6 291.97,64.14 293.37,65.53 294.46,65.53 296.23,67.3 v296.23,69.41 | LED1138.K v296.23,120.14 | v308.02,3.88 308.02,3.14 307.42,2.54 158.42,2.54 158.19,2.31 v157.53,2.31
!II  (via drill 0.3, 0.3 pad 0.55)
  Top 0.152: v279.36,69.31 v279.36,120.14 | v250.39,40.26 250.39,27 248.92,25.53 U1100.9 v248.92,22.35 | v227.33,22.15 U1101.9
  Bottom 0.152: v279.36,69.31 279.36,67.14 277.01,64.8 276.12,64.8 275.46,64.14 U1106.6 275.46,62.13 274.4,61.06 270.81,61.06 258.9,49.16 258.9,42.1 257.39,40.59 250.72,40.59 v250.39,40.26 | LED1123.K v279.36,120.14 | v248.92,22.35 248.35,22.35 248.13,22.13 227.35,22.13 v227.33,22.15
!LCD_E
  Top 0.152: U400.11 102.49,48.67 101.19,47.37 78.77,47.37 68.61,37.21 25.03,37.21 DS400.6
!MEM_IO_EN  (via drill 0.3)
  Top 0.152: U103.10 12.19,122.61 14.45,120.34 v27.43,120.34
  Bottom 0.152: v27.43,120.34 28.32,119.46 28.32,115.14 30.07,113.39 81.66,113.39 84.84,110.21 U213.19
!MEM_MANMODE
  Bottom 0.152: R202.2 74.74,70.1 LED200.A S200.1
!MHI  (via drill 0.3, 0.3 pad 0.55)
  Top 0.152: v73.13,120.55 73.13,122.53 U203.9 | v279.87,68.78 v279.87,115.06 279.87,155.92 v279.43,156.36 | U204.9 51.56,123.14 49.76,124.94 49.76,131.5 48.31,132.94 46.94,132.94 45.16,134.72 45.16,139.27 51.64,145.75 53.59,145.75 57.58,149.73 v57.58,156.36
  Bottom 0.152: U204.9 51.56,121.97 52.98,120.55 v73.13,120.55 | U1106.7 276.73,64.11 277.37,64.75 277.88,64.75 279.87,66.74 v279.87,68.78 | LED1124.K v279.87,115.06 | v279.43,156.36 279.39,156.33 57.6,156.33 v57.58,156.36
!MLI  (via drill 0.3, 0.3 pad 0.55)
  Top 0.152: U201.9 v116.33,120.53 119.28,120.53 120.14,121.39 120.14,125.12 121.03,126.01 127.46,126.01 130.3,128.85 v130.3,156.87 | v280.38,69.31 v280.38,109.98 v280.38,156.36
  Bottom 0.152: U202.9 94.74,121.94 96.16,120.53 v116.33,120.53 | U1106.8 278,64.14 280.38,66.51 v280.38,69.31 | LED1125.K v280.38,109.98 | v130.3,156.87 130.56,156.62 278.93,156.62 279.21,156.9 279.84,156.9 v280.38,156.36
!NO  (via drill 0.3, 0.3 pad 0.55)
  Top 0.152: 5.89,23.52 7.14,22.28 9.7,22.28 v15.58,28.16 18.24,30.81 72.92,30.81 82.29,40.18 97.86,40.18 105.89,48.21 105.89,51.83 C402.1 | 5.89,23.52 5.84,23.57 J400.5 | A200.26 2.08,53.14 2.08,46.11 5.89,42.3 5.89,23.52 | v296.74,115.06 v296.74,68.88 296.74,67.36 298.16,65.94 299.98,65.94 308.08,57.84 308.08,4.97 308.3,4.74 v308.3,4.61 | v97.26,58.67 97.26,62.26 v91.9,67.61
  Bottom 0.152: C402.1 103.89,57.68 102.89,58.67 v97.26,58.67 | U1107.7 293.24,64.14 294.36,65.25 295.07,65.25 296.74,66.92 v296.74,68.88 | v91.9,67.61 91.9,68.48 92.94,69.52 109.53,69.52 110.39,70.38 110.39,72.57 109.98,72.97 108.89,72.97 106.88,74.98 95.07,74.98 91.57,78.49 U401.19 | LED1139.K v296.74,115.06 | v308.3,4.61 308.3,4.32 308.53,4.09 308.53,3.25 307.54,2.26 158.53,2.26 158.08,1.81 157.32,1.81 156.59,2.54 152.43,2.54 151.97,2.09 151.01,2.09 150.28,2.82 68.65,2.82 68.2,2.37 62.45,2.37 60.88,3.94 58.08,3.94 57.62,3.48 56.92,3.48 56.19,4.22 18.91,4.22 16.64,6.49 16.64,27.1 v15.58,28.16
  other vias: 103.89,53.83
!NO_LATCH
  Top 0.152: U400.8 94.87,48.67 95.86,47.68 97.94,47.68 98.5,48.23 98.5,54.86 99.95,56.31 U400.5
!OI  (via drill 0.3, 0.3 pad 0.55)
  Top 0.152: U904.9 138.43,75.59 139.75,76.91 v160.02,76.91 166.11,76.91 167.34,78.13 201.04,78.13 v202.46,79.55 | v280.88,68.78 v280.88,89.53 v280.88,104.9 | v215.12,94.97 v227.41,94.97
  Bottom 0.152: v160.02,76.91 U903.9 | U1106.9 279.27,64.14 280.88,65.75 v280.88,68.78 | LED1126.K v280.88,104.9 | v215.12,94.97 215.12,85.6 214.68,85.17 211.35,85.17 211.03,85.49 208.4,85.49 v202.46,79.55 | v227.41,94.97 232.84,89.53 v280.88,89.53
!OMI  (via drill 0.3 pad 0.55)
  Top 0.152: v281.39,69.31 v281.39,90.12 v281.39,99.82 | v180.49,78.64 200.83,78.64 v202.48,80.28 | v215.11,95.7 216.01,95.7 216.46,95.25 226.97,95.25 227.2,95.48 227.62,95.48 227.62,95.47 v227.94,95.47
  Bottom 0.152: U1106.10 280.54,64.14 281.39,64.98 v281.39,69.31 | LED1127.K v281.39,99.82 | U906.9 181.61,75.49 180.49,76.61 v180.49,78.64 | v202.48,80.28 207.97,85.77 211.15,85.77 211.46,85.45 214.57,85.45 214.84,85.72 214.84,94.53 214.61,94.76 214.61,95.2 v215.11,95.7 | v227.94,95.47 233.6,89.81 280.45,89.81 280.75,90.12 v281.39,90.12
!OO  (via drill 0.3, 0.3 pad 0.55)
  Top 0.152: v297.24,69.41 v297.24,109.98 v297.24,156.24 | v146.05,157.15 146.05,137.14 Q300.1
  Bottom 0.152: v297.24,69.41 297.24,66.86 294.51,64.14 U1107.8 | LED1140.K v297.24,109.98 | v297.24,156.24 296,157.47 278.98,157.47 278.7,157.2 167.12,157.2 166.67,157.65 165.91,157.65 165.18,156.92 146.94,156.92 146.71,157.15 v146.05,157.15
  other vias: 144.61,135.7
!OUT_15  (via drill 0.3)
  Bottom 0.152: U1107.17 294.51,52.7 296.06,51.16 300.45,51.16 301.3,52 v301.3,69.42 300.66,70.05 293.7,70.05 LED1148.K
!PI  (via drill 0.3, 0.3 pad 0.55)
  Top 0.152: v200.41,143.49 U502.9 200.41,146.3 201.37,147.27 201.37,154.53 v200.08,155.82 | v281.9,68.78 v281.9,94.74 v281.9,156.11
  Bottom 0.152: U503.9 178.82,144.93 180.26,143.49 v200.41,143.49 | U1106.11 281.82,63.45 281.9,63.52 v281.9,68.78 | LED1128.K v281.9,94.74 | v281.9,156.11 281.26,156.11 281.01,155.85 226.04,155.85 225.84,156.05 200.92,156.05 200.69,155.82 v200.08,155.82
!PO  (via drill 0.3, 0.3 pad 0.55)
  Top 0.152: v297.75,68.88 v297.75,104.9 v297.75,156.77 | v167.48,157.7 | v167.48,157.7 166.47,156.69 166.47,152.41 172.59,146.29 U505.19
  Bottom 0.152: v297.75,68.88 297.75,66.1 295.78,64.14 U1107.9 | LED1141.K v297.75,104.9 | v297.75,156.77 296.76,157.75 278.86,157.75 278.58,157.47 168.37,157.47 168.14,157.7 v167.48,157.7
!RI  (via drill 0.3, 0.3 pad 0.55)
  Top 0.152: v282.4,89.66 v282.4,69.31 282.4,66.21 283.79,64.82 299.52,64.82 306.96,57.38 306.96,3.92 306.64,3.61 305.54,3.61 305.31,3.83 v305.18,3.83 | v57.15,3.99 U1108.1
  Bottom 0.152: U1106.13 283.08,54.08 283.69,54.69 283.69,65.68 282.4,66.97 v282.4,69.31 | LED1129.K v282.4,89.66 | v305.18,3.83 304.17,3.83 303.71,3.38 68.42,3.38 67.97,2.93 63.32,2.93 62.03,4.22 57.96,4.22 57.73,3.99 v57.15,3.99
!RM  (via drill 0.3)
  Top 0.152: U1108.6 69.85,15.88 73.28,19.3 73.28,28.38 83.12,38.23 99.61,38.23 109.27,47.89 109.27,50.29 109.68,50.7 111.48,50.7 112.52,49.66 115.24,49.66 122.38,56.79 122.38,62.13 v123.47,63.22
  Bottom 0.152: v123.47,63.22 121.74,64.95 121.74,80.97 122.53,81.76 122.53,83.74 123.32,84.53 127.91,84.53 128.91,83.54 U303.5
!RM_INT  (via drill 0.3)
  Top 0.152: v132.38,74.52 131.29,74.52 127,70.23 127,67.82 127.43,67.39 127.43,63.93 122.78,59.28 v122.78,40.72 | v238.66,39.8 238.66,40.87 237.62,41.91 237.62,43.16 238.66,44.2 239.93,44.2 241.28,45.54 241.28,47.85 245.97,52.55 v249.22,52.55
  Bottom 0.152: U303.8 133.99,89.94 135.36,88.57 135.36,77.5 v132.38,74.52 | v122.78,40.72 125.91,37.59 200.13,37.59 200.83,36.89 234.05,36.89 236.53,39.37 238.21,39.37 238.65,39.8 v238.66,39.8 | v249.22,52.55 254.31,52.55 255.27,53.52 U1102.1
!RMSB  (via drill 0.3)
  Top 0.152: U1108.8 72.39,27.89 83.01,38.51 99.5,38.51 108.99,48 108.99,50.41 109.56,50.98 111.59,50.98 112.64,49.94 115.13,49.94 122.1,56.91 122.1,62.58 v122.73,63.22 | v118.01,88.92 120.27,88.92 121.28,89.94 U303.13
  Bottom 0.152: v122.73,63.22 121.46,64.49 121.46,77.55 117.37,81.64 117.37,88.29 v118.01,88.92
!RO  (via drill 0.3, 0.3 pad 0.55)
  Top 0.152: v298.25,99.82 v298.25,69.41 298.25,68.06 308.36,57.96 308.36,5.28 308.81,4.82 308.81,3.88 308.47,3.54 v308.47,2.48 | v60.67,3.43 60.67,21.3 59.69,22.28 U1108.13
  Bottom 0.152: U1107.10 297.05,64.14 298.25,65.34 v298.25,69.41 | LED1142.K v298.25,99.82 | v308.47,2.48 307.97,1.98 158.65,1.98 158.2,1.53 157.21,1.53 156.49,2.24 152.52,2.24 152.09,1.81 150.89,1.81 150.16,2.54 68.77,2.54 68.31,2.09 62.01,2.09 v60.67,3.43
!RST  (via drill 0.3)
  Top 0.152: U500.1 218.19,141.07 217.93,141.33 217.93,142.34 217.15,143.13 217.15,151.54 218.19,152.58 U502.1 | U303.4 126.36,82.35 124.09,80.08 S300.3 122.38,81.18 121.28,82.27 U303.2 121.28,87.4 | U303.12 123.83,89.94 121.28,87.4 | U300.9 100.71,96.83 102.18,95.35 102.18,89.89 104.67,87.4 121.28,87.4 | v187.6,126.11 190.25,128.75 190.25,130.99 194.69,135.43 195.25,135.43 195.6,135.79 195.6,136.09 196.6,137.08 U501.1 | v136.7,123.57 136.7,95.22 v136.75,95.17
  Bottom 0.152: U503.1 196.6,153.8 197.51,154.71 217.19,154.71 218.19,153.72 U502.1 | U500.1 218.19,137.01 217.4,136.22 197.46,136.22 196.6,137.08 U501.1 | R300.1 U303.1 U303.2 | U303.12 123.83,91.21 124.87,92.25 133.83,92.25 v136.75,95.17 | v187.6,126.11 138.61,126.11 136.7,124.21 v136.7,123.57
!SHIFT_IO_EN
  Top 0.152: U302.8 98.17,88.92 99.08,89.84 99.08,103.02 97.23,104.88 97.23,113.74 100.71,117.22 U301.19
!SO  (via drill 0.3, 0.3 pad 0.55)
  Top 0.152: v298.76,68.88 v298.76,94.74 v298.76,156.49 | v80.75,156.86 80.75,134.15 81.65,133.25 85.57,133.25 87.05,131.78 88.75,131.78 89.28,131.24 89.28,113.94 96.9,106.33 96.9,98.78 97.74,97.94 97.74,97.03 96.39,95.68 96.39,86.23 97,85.62 97,82.47 97.66,81.81 102.23,81.81 103.25,82.83 U302.10
  Bottom 0.152: U1107.11 298.32,64.16 298.76,64.6 v298.76,68.88 | LED1143.K v298.76,94.74 | v298.76,156.49 297.22,158.03 278.75,158.03 278.47,157.75 168.48,157.75 168.03,158.21 166.07,158.21 165.06,157.2 147.06,157.2 146.6,157.66 145.84,157.66 145.1,156.92 131.36,156.92 130.9,157.38 130.09,157.38 129.35,156.64 80.97,156.64 v80.75,156.86
!TO  (via drill 0.3, 0.3 pad 0.55)
  Top 0.152: v299.27,69.41 v299.27,89.66 v299.27,153.9
  Bottom 0.152: U1107.13 299.59,54.08 300.18,54.66 300.18,65.29 299.27,66.2 v299.27,69.41 | LED1144.K v299.27,89.66 | v299.27,153.9 v299.26,153.91 245.25,153.91 244.35,153.01 U812.19
!VI  (via drill 0.3, 0.3 pad 0.55)
  Top 0.152: U1000.9 v128.27,21.11 | v149.86,21.11 U1001.9 149.86,18.19 151.33,16.71 v151.33,2.87 | v282.91,84.58 v282.91,68.78 282.91,66.1 283.91,65.1 299.63,65.1 307.24,57.49 307.24,3.81 306.76,3.33 v304.61,3.33 v304.6,3.33
  Bottom 0.152: v128.27,21.11 128.88,21.11 129.11,20.88 133.69,20.88 134.15,21.33 135.1,21.33 135.55,20.88 149.02,20.88 149.25,21.11 v149.86,21.11 | U1106.14 281.81,52.68 282.37,52.12 283.54,52.12 283.97,52.55 283.97,65.79 282.91,66.86 v282.91,68.78 | LED1130.K v282.91,84.58 | v304.6,3.33 304.06,3.33 303.82,3.1 152.19,3.1 151.97,2.87 v151.33,2.87
!VO  (via drill 0.3, 0.3 pad 0.55)
  Top 0.152: v299.78,84.58 v299.78,68.89 299.78,66.94 308.63,58.08 308.63,5.39 309.09,4.94 309.09,3.1 v308.99,3 | v82.27,2.03 82.27,7.09 85.06,9.88 85.06,16.89 86.36,18.19 U1002.19
  Bottom 0.152: U1107.14 298.32,52.7 299.03,51.99 300.1,51.99 300.46,52.35 300.46,65.41 299.78,66.09 v299.78,68.89 | LED1145.K v299.78,84.58 | v308.99,3 308.99,2.28 308.41,1.7 158.76,1.7 158.31,1.25 157.09,1.25 156.38,1.96 152.64,1.96 152.21,1.53 150.78,1.53 150.04,2.26 83.16,2.26 82.93,2.03 v82.27,2.03
!XI  (via drill 0.3, 0.3 pad 0.55)
  Top 0.152: v283.42,79.5 v283.42,69.31 283.42,65.99 284.03,65.38 299.75,65.38 307.52,57.61 v307.52,3.35 | v61.82,3.71 62.23,4.12 U1108.3
  Bottom 0.152: U1106.15 280.54,52.7 281.41,51.84 283.66,51.84 284.25,52.44 284.25,65.91 283.42,66.75 v283.42,69.31 | LED1131.K v283.42,79.5 | v307.52,3.35 306.98,2.82 152.31,2.82 151.86,2.37 151.12,2.37 150.39,3.1 68.53,3.1 68.08,2.65 62.88,2.65 v61.82,3.71
!ZHI  (via drill 0.3, 0.3 pad 0.55)
  Top 0.152: U218.9 v110.49,21.64 | v132.08,21.39 U217.9 132.08,24.18 130.96,25.3 130.96,33.3 132.08,34.42 v132.08,38.23 | v283.92,68.79 v283.92,74.42
  Bottom 0.152: v110.49,21.64 111.15,21.64 111.35,21.85 124.81,21.85 125.52,21.14 126.32,21.14 126.8,21.62 131.19,21.62 131.42,21.39 v132.08,21.39 | v283.92,68.79 283.92,66.63 284.53,66.03 284.53,52.32 283.77,51.56 280.42,51.56 279.27,52.7 U1106.16 279.27,54.94 278.11,56.11 266.25,56.11 259.18,49.04 259.18,41.98 257.51,40.31 251.16,40.31 250.6,39.76 250.18,39.76 249.35,40.59 238.34,40.59 237.88,40.13 236.5,40.13 234.27,37.9 222.72,37.9 222.27,37.44 221.48,37.44 220.75,38.18 191.39,38.18 191.09,37.87 190.67,37.87 190.09,38.46 133.02,38.46 132.79,38.23 v132.08,38.23 | LED1132.K v283.92,74.42
!ZHO  (via drill 0.3, 0.3 pad 0.55)
  Top 0.152: v300.28,79.5 v300.28,69.42 300.28,66.83 308.92,58.19 308.92,5.51 309.37,5.05 309.37,3.78 309.59,3.55 v309.59,3.42 | v120.7,1.75 120.7,7.34 118.59,9.45 106.27,9.45 105.59,10.13 105.59,13.16 107.64,15.21 107.64,19.61 104.14,23.12 U220.19
  Bottom 0.152: U1107.15 297.05,52.7 298.04,51.71 300.22,51.71 300.74,52.23 300.74,65.52 300.28,65.98 v300.28,69.42 | LED1146.K v300.28,79.5 | v309.59,3.42 309.59,2.49 308.52,1.42 158.88,1.42 158.43,0.97 156.97,0.97 156.26,1.68 152.75,1.68 152.32,1.25 150.66,1.25 149.93,1.98 121.56,1.98 121.34,1.75 v120.7,1.75
!ZLI  (via drill 0.3, 0.3 pad 0.55)
  Top 0.152: U216.9 v180.34,21.36 | v201.93,21.39 U215.9 201.93,24.21 200.86,25.27 v200.86,37.67
  Bottom 0.152: v180.34,21.36 181,21.36 181.23,21.59 194.58,21.59 195.03,21.14 196.13,21.14 196.61,21.61 201.04,21.61 201.27,21.39 v201.93,21.39 | LED1133.K 285.6,69.32 v284.43,69.32 284.43,66.52 284.81,66.14 284.81,52.2 283.89,51.28 279.4,51.28 278,52.68 U1106.17 278,54.81 276.99,55.83 266.36,55.83 259.46,48.93 259.46,41.87 257.63,40.03 251.27,40.03 250.72,39.48 250.07,39.48 249.24,40.31 238.45,40.31 237.99,39.85 236.62,39.85 234.38,37.62 222.84,37.62 222.38,37.16 221.37,37.16 220.63,37.9 201.83,37.9 201.6,37.67 v200.86,37.67
!ZLO  (via drill 0.3, 0.3 pad 0.55)
  Top 0.152: v300.79,74.42 v300.79,68.89 300.79,66.72 309.19,58.31 309.19,5.62 309.87,4.94 v309.87,4.16 | U219.19 173.99,23.14 180.29,16.84 184.53,16.84 186.66,14.71 186.66,10.57 190.6,6.63 v190.6,0.92
  Bottom 0.152: U1107.16 295.78,52.7 297.05,51.44 300.33,51.44 301.01,52.12 301.01,65.64 300.79,65.87 v300.79,68.89 | LED1147.K v300.79,74.42 | v309.87,4.16 309.87,4.04 310.1,3.81 310.1,2.6 308.64,1.14 191.51,1.14 191.29,0.92 v190.6,0.92
ALU_B_0  (via drill 0.3)
  Top 0.152: v184.78,60.31 U700.6
  Bottom 0.152: U703.3 217.81,58.62 216.32,60.1 185.55,60.1 185.34,60.31 v184.78,60.31
ALU_B_1  (via drill 0.3)
  Top 0.152: v175.39,60.31 175.39,59.39 174.62,58.63 U700.2
  Bottom 0.152: U703.6 225.43,58.67 223.72,60.38 185.66,60.38 185.23,60.81 184.56,60.81 184.05,60.31 v175.39,60.31
ALU_B_2  (via drill 0.3)
  Top 0.152: v174.62,61.3 U700.15
  Bottom 0.152: U703.8 227.97,65.08 226.19,63.3 187.97,63.3 186.19,61.52 175.41,61.52 175.18,61.3 v174.62,61.3
ALU_B_3  (via drill 0.3)
  Top 0.152: v187.12,63.35 186.43,63.35 184.78,65 U700.11
  Bottom 0.152: U703.11 220.34,65.08 218.85,63.58 187.85,63.58 187.62,63.35 v187.12,63.35
ALU_B_4
  Bottom 0.152: U704.3 198.75,58.67 197.92,59.51 164.01,59.51 163.19,58.7 U701.6
ALU_B_5
  Bottom 0.152: U704.6 206.38,58.62 205.2,59.8 154.14,59.8 153.03,58.7 U701.2
ALU_B_6  (via drill 0.3)
  Top 0.152: v153.03,62.03 U701.15
  Bottom 0.152: U704.8 208.91,65.02 207.75,63.86 186.91,63.86 184.85,61.8 157.81,61.8 157.58,62.03 v153.03,62.03
ALU_B_7  (via drill 0.3)
  Top 0.152: v163.19,62.31 U701.11
  Bottom 0.152: U704.11 201.29,65.1 200.33,64.14 186.79,64.14 184.74,62.08 171.78,62.08 171.55,62.31 v163.19,62.31
ALU_CARRY_OVER  (via drill 0.3)
  Top 0.152: U701.9 168.28,66.29 172.37,70.39 210.69,70.39 210.92,70.61 v211.53,70.61 | U707.11 214.02,91.44 215.21,90.25 215.21,87.07 v216.46,85.83
  Bottom 0.152: v216.46,85.83 217.27,85.01 217.27,79.98 214.76,77.47 214.76,73.84 v211.53,70.61
ALU_INT_CARRY  (via drill 0.3)
  Top 0.152: U701.7 v165.74,60.31 | v189.87,62.79 U700.9
  Bottom 0.152: v165.74,60.31 174.63,60.31 175.47,61.14 188.22,61.14 v189.87,62.79
ALU_SUM_0  (via drill 0.3)
  Top 0.152: v144.15,62.87 U702.2 144.15,66.29 145.69,67.84 154.33,67.84 LED707.A | v179.73,62.87 179.73,58.06 U700.4
  Bottom 0.152: v144.15,62.87 144.81,62.87 145.03,63.09 178.9,63.09 179.12,62.87 v179.73,62.87
ALU_SUM_1  (via drill 0.3)
  Top 0.152: v141.6,62.87 U702.3 141.6,66.24 143.49,68.12 149.91,68.12 LED706.A | v172.09,62.59 U700.1
  Bottom 0.152: v141.6,62.87 142.11,62.36 144.69,62.36 145.15,62.81 171.28,62.81 171.5,62.59 v172.09,62.59
ALU_SUM_2  (via drill 0.3)
  Top 0.152: v139.06,63.43 U702.4 139.06,66.27 141.2,68.4 145.49,68.4 LED705.A
  Bottom 0.152: U700.13 179.71,64.97 178.38,63.65 139.9,63.65 139.68,63.43 v139.06,63.43
ALU_SUM_3  (via drill 0.3)
  Top 0.152: v136.53,63.43 U702.5 136.53,66.27 138.68,68.43 140.82,68.43 LED704.A
  Bottom 0.152: U700.10 187.32,65.08 185.62,63.37 140.03,63.37 139.58,62.92 138.83,62.92 138.33,63.43 v136.53,63.43
ALU_SUM_4  (via drill 0.3)
  Top 0.152: v133.99,63.43 U702.6 133.99,66.24 137.29,69.55 LED703.A | v158.12,62.31 U701.4
  Bottom 0.152: v133.99,63.43 134.77,62.64 141.12,62.64 141.68,62.08 144.81,62.08 145.26,62.53 157.28,62.53 157.5,62.31 v158.12,62.31
ALU_SUM_5  (via drill 0.3)
  Top 0.152: v131.44,63.43 U702.7 131.44,68.45 LED702.A | v150.5,62.03 U701.1
  Bottom 0.152: v131.44,63.43 133.07,61.8 144.92,61.8 145.38,62.26 149.71,62.26 149.94,62.03 v150.5,62.03
ALU_SUM_6
  Top 0.152: LED701.A 128.91,68.58 U702.8
  Bottom 0.152: U701.13 158.12,65.05 157.28,64.21 129.69,64.21 128.91,65 U702.8
ALU_SUM_7